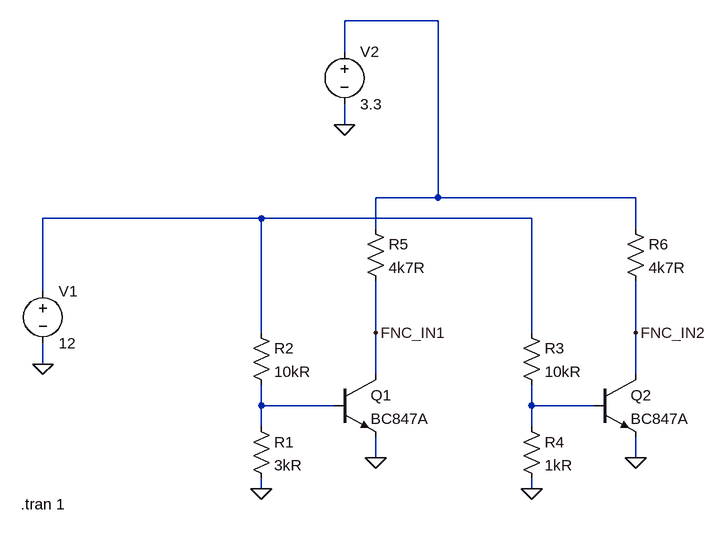
[diagram p0: schematic FUNCTION_circuit.asc]
FUNCTION_circuit.asc, the LTspice schematic file:
Version 4
SHEET 1 880 680
WIRE 288 -304 144 -304
WIRE 144 -256 144 -304
WIRE 144 -144 144 -176
WIRE 288 -32 288 -304
WIRE 288 -32 192 -32
WIRE 592 -32 288 -32
WIRE 16 0 -320 0
WIRE 432 0 16 0
WIRE 192 16 192 -32
WIRE 592 16 592 -32
WIRE -320 112 -320 0
WIRE 16 176 16 0
WIRE 192 176 192 96
WIRE 432 176 432 0
WIRE 592 176 592 96
WIRE -320 224 -320 192
WIRE 192 240 192 176
WIRE 592 240 592 176
WIRE 16 288 16 256
WIRE 128 288 16 288
WIRE 432 288 432 256
WIRE 528 288 432 288
WIRE 16 320 16 288
WIRE 432 320 432 288
WIRE 192 368 192 336
WIRE 592 368 592 336
WIRE 16 416 16 400
WIRE 432 416 432 400
FLAG 192 368 0
FLAG 592 368 0
FLAG 16 416 0
FLAG 432 416 0
FLAG -320 224 0
FLAG 144 -144 0
FLAG 192 176 FNC_IN1
FLAG 592 176 FNC_IN2
SYMBOL npn 128 240 R0
SYMATTR InstName Q1
SYMATTR Value BC847A
SYMBOL npn 528 240 R0
SYMATTR InstName Q2
SYMATTR Value BC847A
SYMBOL res 0 304 R0
SYMATTR InstName R1
SYMATTR Value 3kR
SYMBOL res 0 160 R0
SYMATTR InstName R2
SYMATTR Value 10kR
SYMBOL res 416 160 R0
SYMATTR InstName R3
SYMATTR Value 10kR
SYMBOL res 416 304 R0
SYMATTR InstName R4
SYMATTR Value 1kR
SYMBOL voltage -320 96 R0
WINDOW 123 0 0 Left 0
WINDOW 39 0 0 Left 0
SYMATTR InstName V1
SYMATTR Value 12
SYMBOL res 176 0 R0
SYMATTR InstName R5
SYMATTR Value 4k7R
SYMBOL res 576 0 R0
SYMATTR InstName R6
SYMATTR Value 4k7R
SYMBOL voltage 144 -272 R0
WINDOW 123 0 0 Left 0
WINDOW 39 0 0 Left 0
SYMATTR InstName V2
SYMATTR Value 3.3
TEXT -354 440 Left 2 !.tran 1

The netlist it stands for:
* FUNCTION_circuit.asc
Q1 FNC_IN1 N003 0 0 BC847A
Q2 FNC_IN2 N004 0 0 BC847A
R1 N003 0 3kR
R2 N002 N003 10kR
R3 N002 N004 10kR
R4 N004 0 1kR
V1 N002 0 12
R5 N001 FNC_IN1 4k7R
R6 N001 FNC_IN2 4k7R
V2 N001 0 3.3
.model NPN NPN
.model PNP PNP
.lib standard.bjt
.tran 1
.backanno
.end